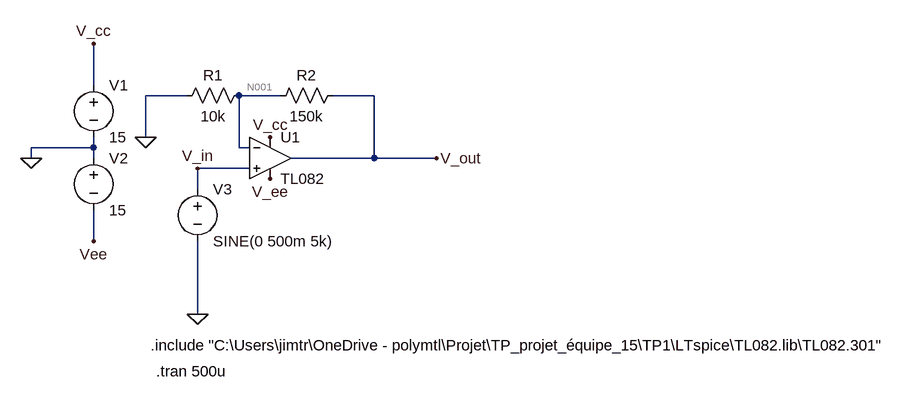
[diagram p0: schematic non_inverseur.asc]
non_inverseur.asc, the LTspice schematic file:
Version 4.1
SHEET 1 1436 680
WIRE 48 64 48 0
WIRE 192 80 128 80
WIRE 336 80 272 80
WIRE 480 80 416 80
WIRE 128 144 128 80
WIRE 48 160 48 144
WIRE 48 160 -48 160
WIRE 272 160 272 80
WIRE 288 160 272 160
WIRE -48 176 -48 160
WIRE 48 176 48 160
WIRE 480 176 480 80
WIRE 480 176 352 176
WIRE 576 176 480 176
WIRE 288 192 208 192
WIRE 208 224 208 192
WIRE 48 304 48 256
WIRE 208 416 208 304
FLAG 128 144 0
FLAG 208 192 V_in
FLAG 576 176 V_out
FLAG -48 176 0
FLAG 48 0 V_cc
FLAG 48 304 Vee
FLAG 320 144 V_cc
FLAG 320 208 V_ee
FLAG 208 416 0
DATAFLAG 48 48 ""
DATAFLAG 48 272 ""
SYMBOL res 288 64 R90
WINDOW 0 0 56 VBottom 2
WINDOW 3 32 56 VTop 2
SYMATTR InstName R1
SYMATTR Value 10k
SYMBOL res 432 64 R90
WINDOW 0 0 56 VBottom 2
WINDOW 3 32 56 VTop 2
SYMATTR InstName R2
SYMATTR Value 150k
SYMBOL voltage 48 160 R0
WINDOW 123 0 0 Left 0
WINDOW 39 0 0 Left 0
SYMATTR InstName V2
SYMATTR Value 15
SYMBOL voltage 48 48 R0
WINDOW 123 0 0 Left 0
WINDOW 39 0 0 Left 0
SYMATTR InstName V1
SYMATTR Value 15
SYMBOL OpAmps\\opamp2 320 112 R0
SYMATTR InstName U1
SYMATTR Value TL082
SYMBOL voltage 208 208 R0
WINDOW 123 0 0 Left 0
WINDOW 39 0 0 Left 0
SYMATTR InstName V3
SYMATTR Value SINE(0 500m 5k)
TEXT 136 464 Left 2 !.include "C:\\Users\\jimtr\\OneDrive - polymtl\\Projet\\TP_projet_équipe_15\\TP1\\LTspice\\TL082.lib\\TL082.301"
TEXT 144 504 Left 2 !.tran 500u

The netlist it stands for:
* non_inverseur.asc
R1 N001 0 10k
R2 V_out N001 150k
V2 0 Vee 15
V1 V_cc 0 15
X§U1 V_in N001 V_cc V_ee V_out TL082  ; pins In+ In- V+ V- OUT
V3 V_in 0 SINE(0 500m 5k)
.include "C:\Users\jimtr\OneDrive - polymtl\Projet\TP_projet_équipe_15\TP1\LTspice\TL082.lib\TL082.301"
.tran 500u
.backanno
.end

* Results of the author's LTspice run, read from the files saved beside the schematic
* Operating Point, zero values left out:
*   V(n001) = 4.467 V
*   V(v_cc) = 15 V
*   V(v_ee) = 8.259 V
*   V(v_out) = 13.52 V
*   V(vee) = -15 V
*   I(R1) = 446.7 µA
*   I(R2) = 60.38 µA
*   I(V1) = -2.161 mA
*   I(V3) = 2.965 mA
*   Ix(u1:1) = -2.965 mA
*   Ix(u1:2) = -386.3 µA
*   Ix(u1:3) = 2.161 mA
*   Ix(u1:5) = -60.38 µA